# Altium schematic sheet Sensors.SchDoc
size Tabloid; DrawnBy: V-P.Rheaume@USherbrooke.ca; Organization: Universite de Sherbrooke; Address1: L3, 12a Rodborough Rd; Address2: Frenchs Forest; Address3: NSW; Address4: Australia 2086; Revision: 0; SheetNumber: 7; SheetTotal: 8; SheetName: Sensors
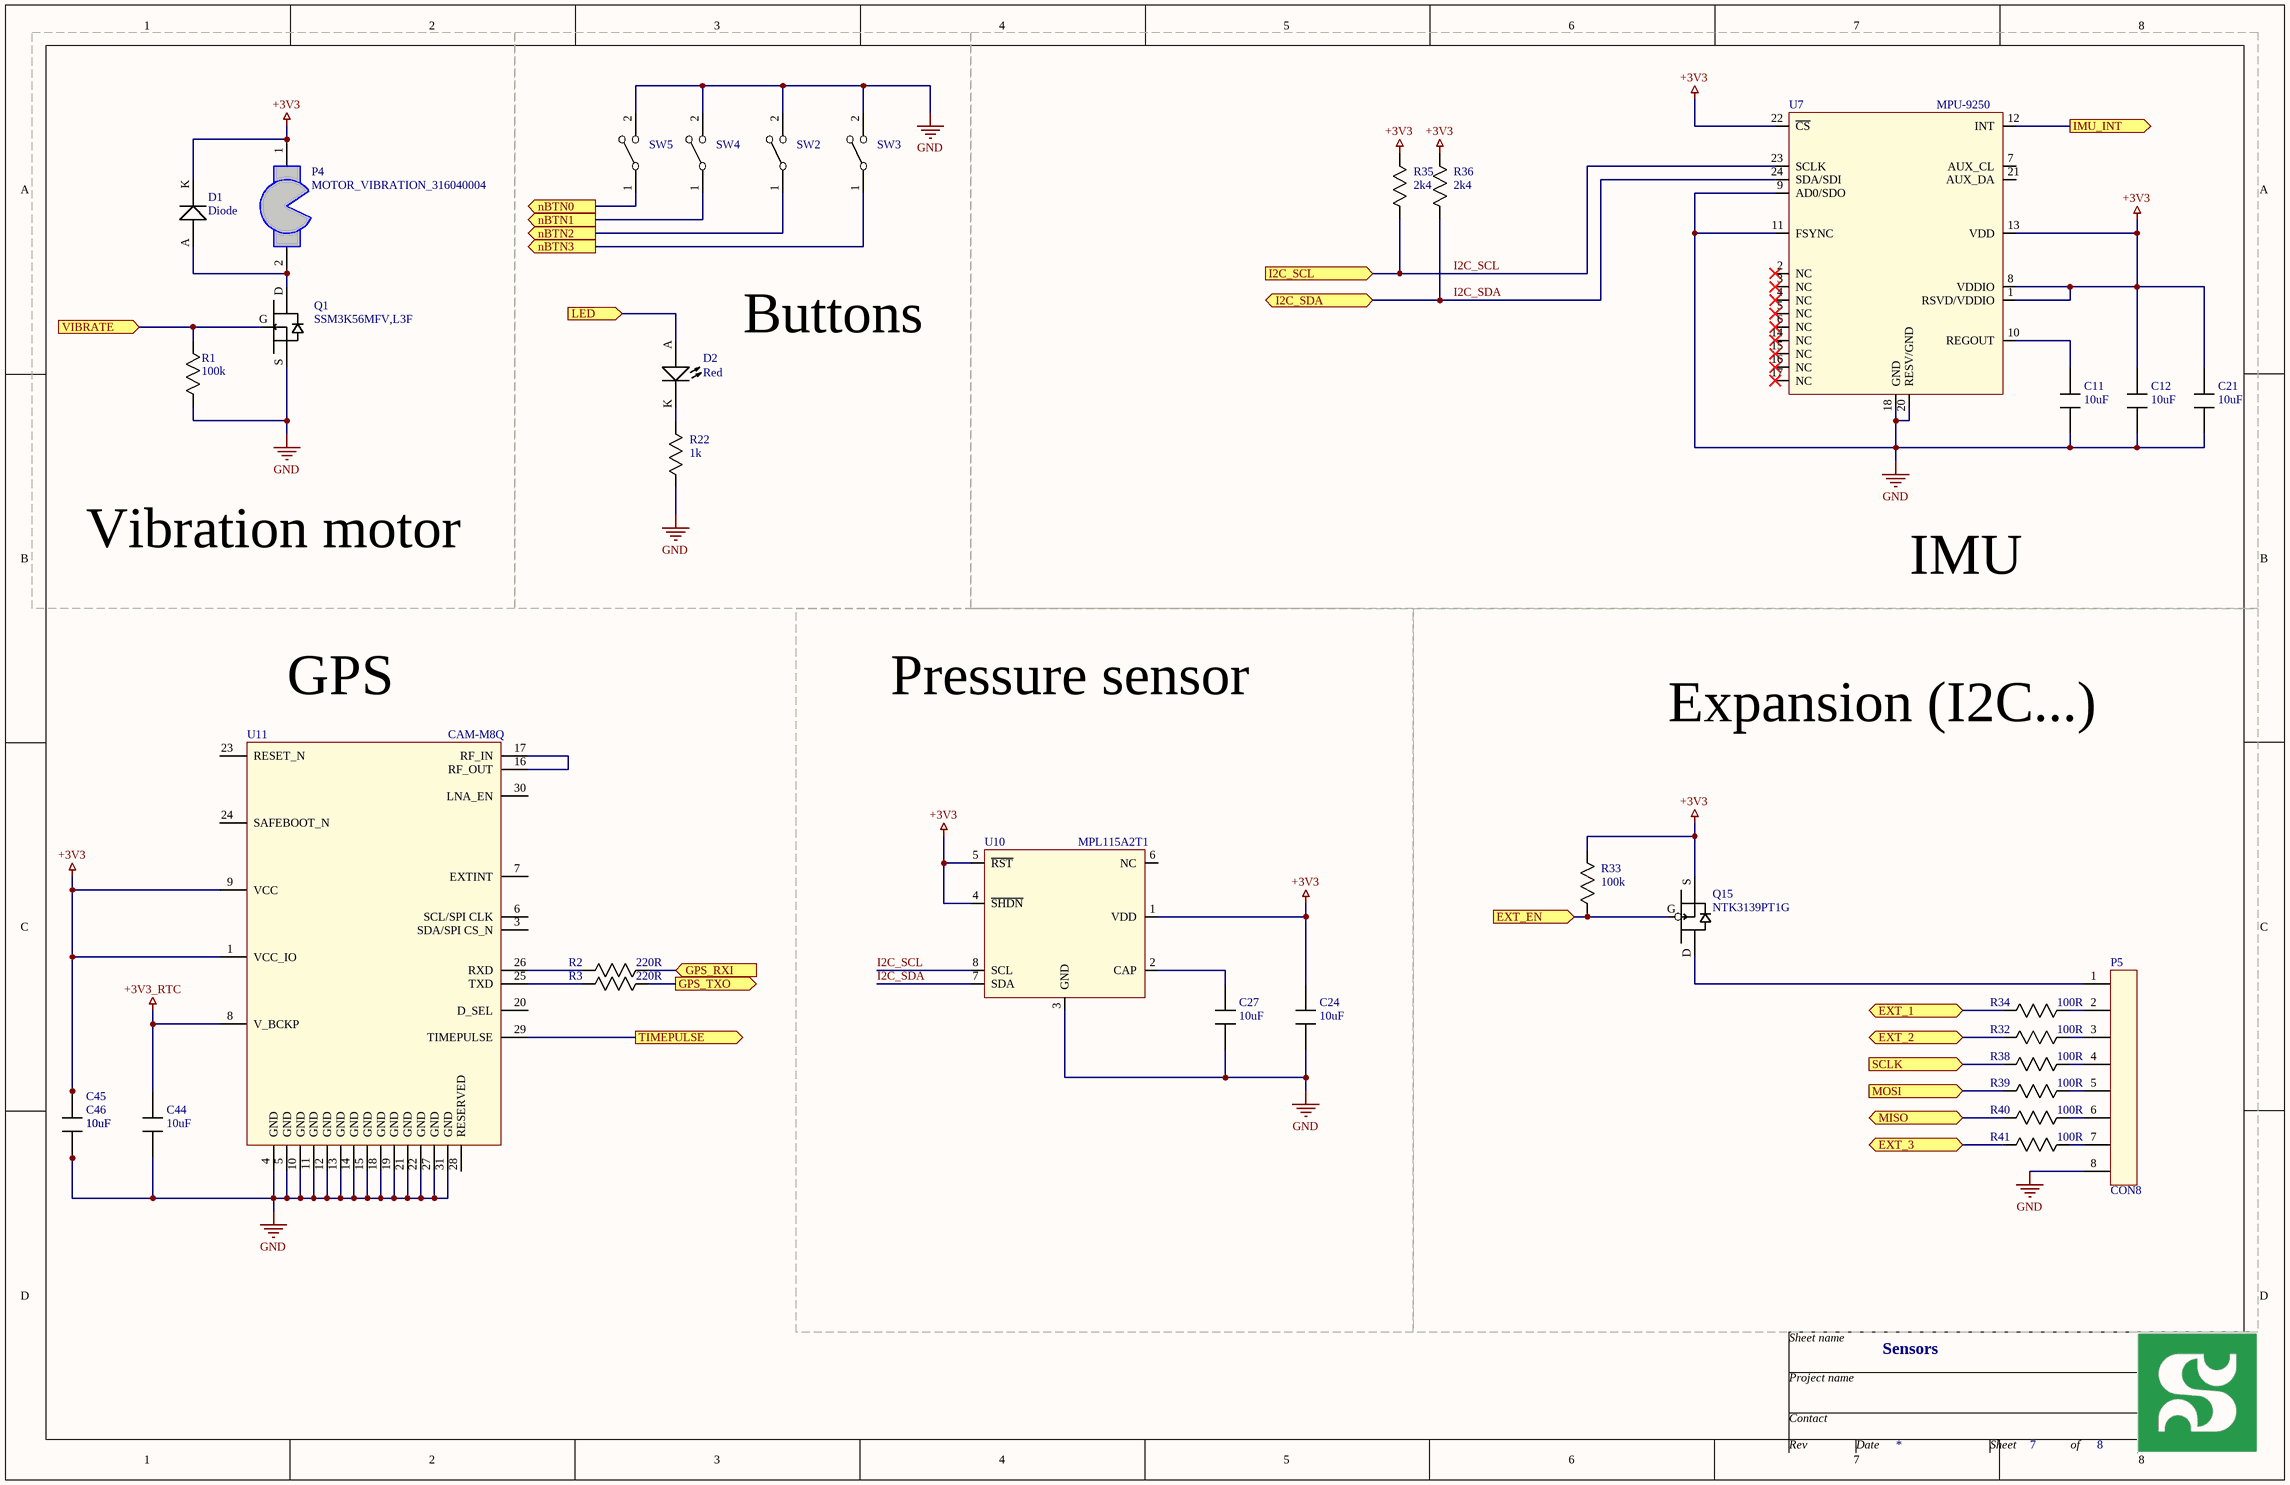
[diagram p0: Sensors.SchDoc]

## Parts
C11  value 10uF  [0603]  (hidden comment: Capacitor)
C12  value 10uF  [0603]  (hidden comment: Capacitor)
C21  value 10uF  [0603]  (hidden comment: Capacitor)
C24  value 10uF  [0603]  (hidden comment: Capacitor)
C27  value 10uF  [0603]  (hidden comment: Capacitor)
C44  value 10uF  [0603]  (hidden comment: Capacitor)
C45  value 10uF  [0603]  (hidden comment: Capacitor)
C46  value 10uF  [0603]  (hidden comment: Capacitor)
D1  Diode  [DIODE_SOD523]
D2  value Red  [0805_LED]  (hidden comment: Diode_LED)
P4  MOTOR_VIBRATION_316040004  [MOTOR_VIBRATION_316040004]
P5  CON8  [CONN8_JSTSH]
Q1  Mfg_PN: SSM3K56MFV,L3F  [SOT723]  (hidden comment: MOSFET_N_GDS)
Q15  Mfg_PN: NTK3139PT1G  [SOT723]  (hidden comment: MOSFET_P_GDS)
R1  value 100k  [0402]  (hidden comment: Resistor)
R2  value 220R  [0805]  (hidden comment: Resistor)
R3  value 220R  [0805]  (hidden comment: Resistor)
R22  value 1k  [0402]  (hidden comment: Resistor)
R32  value 100R  [0402]  (hidden comment: Resistor)
R33  value 100k  [0402]  (hidden comment: Resistor)
R34  value 100R  [0402]  (hidden comment: Resistor)
R35  value 2k4  [0402]  (hidden comment: Resistor)
R36  value 2k4  [0402]  (hidden comment: Resistor)
R38  value 100R  [0402]  (hidden comment: Resistor)
R39  value 100R  [0402]  (hidden comment: Resistor)
R40  value 100R  [0402]  (hidden comment: Resistor)
R41  value 100R  [0402]  (hidden comment: Resistor)
SW2  Button_2pins  [BUTTON_EVP-AW]  (value not drawn)
SW3  Button_2pins  [BUTTON_EVP-AW]  (value not drawn)
SW4  Button_2pins  [BUTTON_EVP-AW]  (value not drawn)
SW5  Button_2pins  [BUTTON_EVP-AW]  (value not drawn)
U7  MPU-9250  [QFN24-0.4mm-NOPAD]
U10  MPL115A2T1  [MPL115A2T1]
U11  CAM-M8Q  [CAM-M8]

## Blocks framed on the sheet
Vibration motor: D1 P4 Q1 R1
IMU: C11 C12 C21 R35 R36 U7
Pressure sensor: C24 C27 U10
Expansion (I2C...): P5 Q15 R32-R34 R38-R41

## Ports
EXT_1 (bidir), EXT_2 (bidir), EXT_3 (bidir), EXT_EN (in), GPS_RXI (in), GPS_TXO (out), I2C_SCL (in), I2C_SDA (bidir), IMU_INT (out), LED (in), MISO (bidir), MOSI (in), nBTN0 (out), nBTN1 (out), nBTN2 (out), nBTN3 (out), SCLK (in), TIMEPULSE (out), VIBRATE (in)

## Nets
+3V3: C12.1 C21.1 C24.1 C45.1 C46.1 D1.K P4.1 Q15.S R33.2 R35.1 R36.1 U7.1(RSVD/VDDIO) U7.8(VDDIO) U7.13(VDD) U7.22(~{CS}) U10.1(VDD) U10.4(~{SHDN}) U10.5(~{RST}) U11.1(VCC_IO) U11.9(VCC)
+3V3_RTC: C44.1 U11.8(V_BCKP)
GND: C11.2 C12.2 C21.2 C24.2 C27.2 C44.2 C45.2 C46.2 P5.8 Q1.S R1.2 R22.1 SW2.2 SW3.2 SW4.2 SW5.2 U7.9(AD0/SDO) U7.11(FSYNC) U7.18(GND) U7.20(RESV/GND) U10.3(GND) U11.4(GND) U11.5(GND) U11.10(GND) U11.11(GND) U11.12(GND) U11.13(GND) U11.14(GND) U11.15(GND) U11.18(GND) U11.19(GND) U11.21(GND) U11.22(GND) U11.27(GND) U11.31(GND)
EXT_1: R34.2 ; port EXT_1
EXT_2: R32.2 ; port EXT_2
EXT_3: R41.2 ; port EXT_3
EXT_EN: Q15.G R33.1 ; port EXT_EN
GPS_RXI: R2.1 ; port GPS_RXI
GPS_TXO: R3.1 ; port GPS_TXO
I2C_SCL: R35.2 U7.23(SCLK) U10.8(SCL) ; port I2C_SCL
I2C_SDA: R36.2 U7.24(SDA/SDI) U10.7(SDA) ; port I2C_SDA
IMU_INT: U7.12(INT) ; port IMU_INT
LED: D2.A ; port LED
MISO: R40.2 ; port MISO
MOSI: R39.2 ; port MOSI
nBTN0: SW5.1 ; port nBTN0
nBTN1: SW4.1 ; port nBTN1
nBTN2: SW2.1 ; port nBTN2
nBTN3: SW3.1 ; port nBTN3
SCLK: R38.2 ; port SCLK
TIMEPULSE: U11.29(TIMEPULSE) ; port TIMEPULSE
VIBRATE: Q1.G R1.1 ; port VIBRATE
NetC11_1: C11.1 U7.10(REGOUT)
NetC27_1: C27.1 U10.2(CAP)
NetD1_A: D1.A P4.2 Q1.D
NetD2_K: D2.K R22.2
NetP5_1: P5.1 Q15.D
NetP5_2: P5.2 R34.1
NetP5_3: P5.3 R32.1
NetP5_4: P5.4 R38.1
NetP5_5: P5.5 R39.1
NetP5_6: P5.6 R40.1
NetP5_7: P5.7 R41.1
NetR2_2: R2.2 U11.26(RXD)
NetR3_2: R3.2 U11.25(TXD)
NetU11_16: U11.16(RF_OUT) U11.17(RF_IN)

Not connected (* = marked no-connect by the designer): U7 2(NC)* 3(NC)* 4(NC)* 5(NC)* 6(NC)* 7(AUX_CL) 14(NC)* 15(NC)* 16(NC)* 17(NC)* 19(RESV/NC) 21(AUX_DA); U10 6(NC); U11 2(RESERVED) 3(SDA/SPI_CS_N) 6(SCL/SPI_CLK) 7(EXTINT) 20(D_SEL) 23(RESET_N) 24(SAFEBOOT_N) 28(RESERVED) 30(LNA_EN)

## Notes on the sheet
- Buttons
- (near U11) GPS
- Sheet name
- Project name
- Contact
- Rev
- Date
- Sheet
- of

## Library data of the parts
C11 C12 C21 C24 C27 C44-C46 = Capacitor: Mfg: Murata; Mfg_PN: GRM188R60J106ME47D; HelpURL: *; NI: *; Supplier1: Digikey; Supplier1_PN: 490-3896-1-ND; Tolerance: *; Type: *; Rating: *
D1 = Diode: Mfg: MCC; Mfg_PN: 1N4148X-TP; HelpURL: *; NI: *; Supplier1: Digikey; Supplier1_PN: 1N4148XTPMSCT-ND; Tolerance: *; Type: *; Rating: *; Value: *
D2 = Diode_LED: LED; Mfg: Wurth; Mfg_PN: 150080RS75000; HelpURL: *; NI: *; Supplier1: Digikey; Supplier1_PN: 732-4984-1-ND; Tolerance: *; Type: *; Rating: *
P4 = MOTOR_VIBRATION_316040004: Round, flat, 10-mm diameter, 3-mm thick vibration motor; Mfg: Seeed; HelpURL: *; Mfg_PN: 316040004; NI: *; Rating: *; Supplier1: Digikey; Supplier1_PN: 1597-1245-ND; Tolerance: *; Type: *; Value: *
P5 = CON8: 8-pins; Mfg: JST; Mfg_PN: SM08B-SRSS-TB(LF)(SN); HelpURL: *; NI: *; Rating: *; Supplier1: Digikey; Supplier1_PN: 455-1808-1-ND; Tolerance: *; Type: *; Value: *
Q1 = MOSFET_N_GDS: NMOS; Mfg: Toshiba; HelpURL: *; NI: *; Rating: *; Supplier1: Digikey; Supplier1_PN: SSM3K56MFVL3FCT-ND; Tolerance: *; Type: *; Value: *
Q15 = MOSFET_P_GDS: PMOS; Mfg: OnSemi; HelpURL: *; NI: *; Rating: *; Supplier1: Digikey; Supplier1_PN: NTK3139PT1GOSCT-ND; Tolerance: *; Type: *; Value: *
R1 R33 = Resistor: Mfg: Yageo; Mfg_PN: RC0402JR-07100KL; HelpURL: *; NI: *; Supplier1: Digikey; Supplier1_PN: 311-100KJRCT-ND; Type: *; Rating: *; Tolerance: *
R2 R3 = Resistor: Mfg: Stackpole; Mfg_PN: RMCF0805JT220R; HelpURL: *; NI: *; Supplier1: Digikey; Supplier1_PN: RMCF0805JT220RCT-ND; Type: *; Rating: *; Tolerance: *
R22 = Resistor: Mfg: TE; Mfg_PN: CRG0402J1K0; HelpURL: *; NI: *; Supplier1: Digikey; Supplier1_PN: A106129CT-ND; Type: *; Rating: *; Tolerance: *
R32 R34 R38-R41 = Resistor: Mfg: TE; Mfg_PN: CRG0402J100R/10; HelpURL: *; NI: *; Supplier1: Digikey; Supplier1_PN: A121522CT-ND; Type: *; Rating: *; Tolerance: *
R35 R36 = Resistor: Mfg: Yageo; Mfg_PN: RC0402JR-072K4L; HelpURL: *; NI: *; Supplier1: Digikey; Supplier1_PN: 311-2.4KJRCT-ND; Type: *; Rating: *; Tolerance: *
SW2-SW5 = Button_2pins: Button; Mfg: Panasonic; Mfg_PN: EVP-AWBD2A; HelpURL: *; NI: *; Rating: *; Tolerance: *; Value: *; Supplier1: Digikey; Supplier1_PN: P19743CT-ND
U7 = MPU-9250: IMU ACCEL/GYRO/MAG I2C/SPI 24QFN; Mfg: Invensense; HelpURL: *; NI: *; Rating: *; Supplier1: Digikey; Supplier1_PN: 1428-1019-1-ND; Tolerance: *; Type: *; Value: *; Mfg_PN: MPU-9250
U10 = MPL115A2T1: IC BAROMETER I2C; Mfg: NXP; HelpURL: *; Mfg_PN: MPL115A2T1; NI: *; Rating: *; Supplier1: Digikey; Supplier1_PN: MPL115A2T1CT-ND; Tolerance: *; Type: *; Value: *
U11 = CAM-M8: u-blox CAM GNSS antenna module; Mfg_PN: CAM-M8Q-0; Value: CAM-M8Q; Mfg: u-blox; Supplier1: Digikey; Supplier1_PN: 672-1013-1-ND